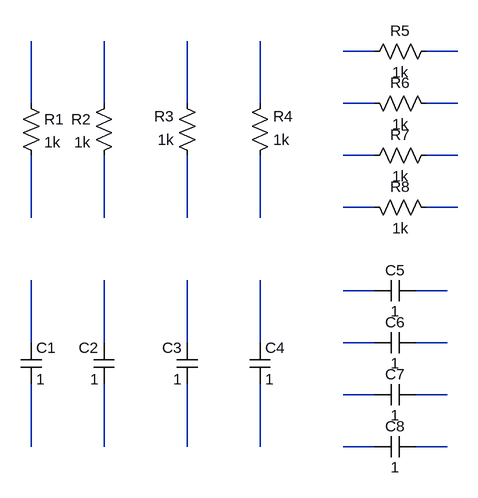
[diagram p0: schematic P2.asc]
P2.asc, the LTspice schematic file:
Version 4
SHEET 1 2948 1524
WIRE 592 112 544 112
WIRE 720 112 672 112
WIRE 64 192 64 96
WIRE 176 192 176 96
WIRE 304 192 304 96
WIRE 416 192 416 96
WIRE 592 192 544 192
WIRE 720 192 672 192
WIRE 592 272 544 272
WIRE 720 272 672 272
WIRE 592 352 544 352
WIRE 720 352 672 352
WIRE 64 368 64 272
WIRE 176 368 176 272
WIRE 304 368 304 272
WIRE 416 368 416 272
WIRE 592 480 544 480
WIRE 704 480 656 480
WIRE 64 560 64 464
WIRE 176 560 176 464
WIRE 304 560 304 464
WIRE 416 560 416 464
WIRE 592 560 544 560
WIRE 704 560 656 560
WIRE 592 640 544 640
WIRE 704 640 656 640
WIRE 64 720 64 624
WIRE 176 720 176 624
WIRE 304 720 304 624
WIRE 416 720 416 624
WIRE 592 720 544 720
WIRE 704 720 656 720
SYMBOL res 48 176 R0
SYMATTR InstName R1
SYMATTR Value 1k
SYMBOL res 192 176 M0
SYMATTR InstName R2
SYMATTR Value 1k
SYMBOL res 320 288 R180
WINDOW 0 36 76 Left 2
WINDOW 3 36 40 Left 2
SYMATTR InstName R3
SYMATTR Value 1k
SYMBOL res 400 288 M180
WINDOW 0 36 76 Left 2
WINDOW 3 36 40 Left 2
SYMATTR InstName R4
SYMATTR Value 1k
SYMBOL res 688 96 R90
WINDOW 0 0 56 VBottom 2
WINDOW 3 32 56 VTop 2
SYMATTR InstName R5
SYMATTR Value 1k
SYMBOL res 576 176 M90
WINDOW 0 0 56 VBottom 2
WINDOW 3 32 56 VTop 2
SYMATTR InstName R6
SYMATTR Value 1k
SYMBOL res 576 288 R270
WINDOW 0 32 56 VTop 2
WINDOW 3 0 56 VBottom 2
SYMATTR InstName R7
SYMATTR Value 1k
SYMBOL res 688 368 M270
WINDOW 0 32 56 VTop 2
WINDOW 3 0 56 VBottom 2
SYMATTR InstName R8
SYMATTR Value 1k
SYMBOL cap 48 560 R0
SYMATTR InstName C1
SYMATTR Value 1
SYMBOL cap 192 560 M0
SYMATTR InstName C2
SYMATTR Value 1
SYMBOL cap 320 624 R180
WINDOW 0 24 56 Left 2
WINDOW 3 24 8 Left 2
SYMATTR InstName C3
SYMATTR Value 1
SYMBOL cap 400 624 M180
WINDOW 0 24 56 Left 2
WINDOW 3 24 8 Left 2
SYMATTR InstName C4
SYMATTR Value 1
SYMBOL cap 656 464 R90
WINDOW 0 0 32 VBottom 2
WINDOW 3 32 32 VTop 2
SYMATTR InstName C5
SYMATTR Value 1
SYMBOL cap 592 544 M90
WINDOW 0 0 32 VBottom 2
WINDOW 3 32 32 VTop 2
SYMATTR InstName C6
SYMATTR Value 1
SYMBOL cap 592 656 R270
WINDOW 0 32 32 VTop 2
WINDOW 3 0 32 VBottom 2
SYMATTR InstName C7
SYMATTR Value 1
SYMBOL cap 656 736 M270
WINDOW 0 32 32 VTop 2
WINDOW 3 0 32 VBottom 2
SYMATTR InstName C8
SYMATTR Value 1

The netlist it stands for:
* P2.asc
R1 N003 N013 1k
R2 N004 N014 1k
R3 N015 N005 1k
R4 N016 N006 1k
R5 N002 N001 1k
R6 N007 N008 1k
R7 N009 N010 1k
R8 N012 N011 1k
C1 N019 N027 1
C2 N020 N028 1
C3 N029 N021 1
C4 N030 N022 1
C5 N018 N017 1
C6 N023 N024 1
C7 N025 N026 1
C8 N032 N031 1
.backanno
.end